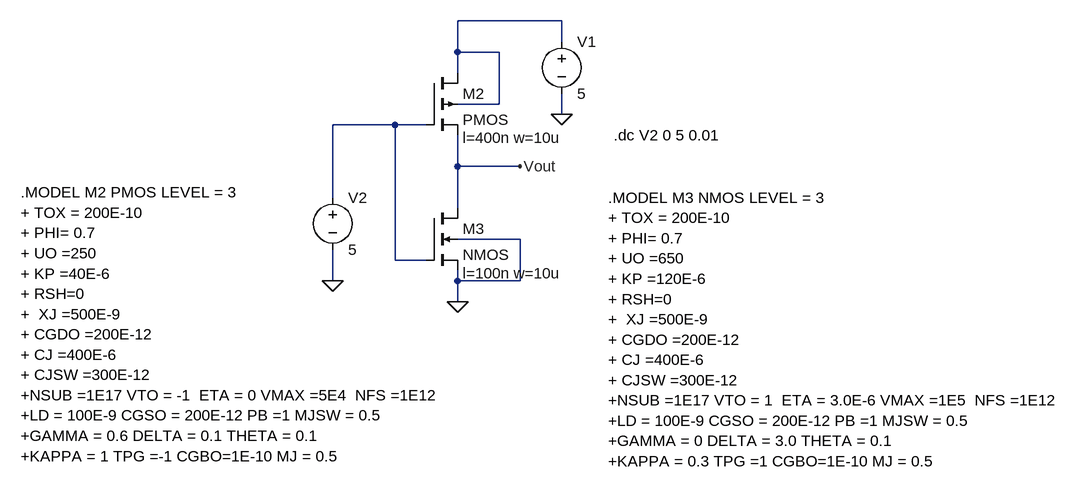
[diagram p0: schematic CMOS (Volatge Transfer Charecteristics).asc]
CMOS (Volatge Transfer Charecteristics).asc, the LTspice schematic file:
Version 4.1
SHEET 1 1100 680
WIRE 304 -32 144 -32
WIRE 304 0 304 -32
WIRE 144 16 144 -32
WIRE 208 16 144 16
WIRE 144 48 144 16
WIRE 208 96 208 16
WIRE 208 96 144 96
WIRE 304 112 304 80
WIRE 48 128 -48 128
WIRE 96 128 48 128
WIRE 144 192 144 144
WIRE 240 192 144 192
WIRE -48 240 -48 128
WIRE 144 256 144 192
WIRE 240 304 144 304
WIRE 48 336 48 128
WIRE 96 336 48 336
WIRE -48 368 -48 320
WIRE 144 368 144 352
WIRE 240 368 240 304
WIRE 240 368 144 368
WIRE 144 400 144 368
FLAG 304 112 0
FLAG -48 368 0
FLAG 240 192 Vout
FLAG 144 400 0
SYMBOL voltage 304 -16 R0
WINDOW 123 0 0 Left 0
WINDOW 39 0 0 Left 0
SYMATTR InstName V1
SYMATTR Value 5
SYMBOL voltage -48 224 R0
WINDOW 123 0 0 Left 0
WINDOW 39 0 0 Left 0
SYMATTR InstName V2
SYMATTR Value 5
SYMBOL nmos4 96 256 R0
WINDOW 123 56 100 Left 2
SYMATTR Value2 l=100n w=10u
SYMATTR InstName M3
SYMBOL pmos4 96 48 R0
WINDOW 123 56 100 Left 2
SYMATTR Value2 l=400n w=10u
SYMATTR InstName M2
TEXT 376 240 Left 2 !.MODEL M3 NMOS LEVEL = 3\n+ TOX = 200E-10\n+ PHI= 0.7\n+ UO =650\n+ KP =120E-6\n+ RSH=0\n+  XJ =500E-9\n+ CGDO =200E-12\n+ CJ =400E-6\n+ CJSW =300E-12\n+NSUB =1E17 VTO = 1  ETA = 3.0E-6 VMAX =1E5  NFS =1E12\n+LD = 100E-9 CGSO = 200E-12 PB =1 MJSW = 0.5\n+GAMMA = 0 DELTA = 3.0 THETA = 0.1\n+KAPPA = 0.3 TPG =1 CGBO=1E-10 MJ = 0.5
TEXT -528 232 Left 2 !.MODEL M2 PMOS LEVEL = 3\n+ TOX = 200E-10\n+ PHI= 0.7\n+ UO =250\n+ KP =40E-6\n+ RSH=0\n+  XJ =500E-9\n+ CGDO =200E-12\n+ CJ =400E-6\n+ CJSW =300E-12\n+NSUB =1E17 VTO = -1  ETA = 0 VMAX =5E4  NFS =1E12\n+LD = 100E-9 CGSO = 200E-12 PB =1 MJSW = 0.5\n+GAMMA = 0.6 DELTA = 0.1 THETA = 0.1\n+KAPPA = 1 TPG =-1 CGBO=1E-10 MJ = 0.5
TEXT 384 144 Left 2 !.dc V2 0 5 0.01

The netlist it stands for:
* CMOS (Volatge Transfer Charecteristics).asc
V1 N001 0 5
V2 N002 0 5
M3 Vout N002 0 0 NMOS l=100n w=10u
M2 N001 N002 Vout N001 PMOS l=400n w=10u
.model NMOS NMOS
.model PMOS PMOS
.lib standard.mos
.MODEL M3 NMOS LEVEL = 3
+ TOX = 200E-10
+ PHI= 0.7
+ UO =650
+ KP =120E-6
+ RSH=0
+  XJ =500E-9
+ CGDO =200E-12
+ CJ =400E-6
+ CJSW =300E-12
+NSUB =1E17 VTO = 1  ETA = 3.0E-6 VMAX =1E5  NFS =1E12
+LD = 100E-9 CGSO = 200E-12 PB =1 MJSW = 0.5
+GAMMA = 0 DELTA = 3.0 THETA = 0.1
+KAPPA = 0.3 TPG =1 CGBO=1E-10 MJ = 0.5
.MODEL M2 PMOS LEVEL = 3
+ TOX = 200E-10
+ PHI= 0.7
+ UO =250
+ KP =40E-6
+ RSH=0
+  XJ =500E-9
+ CGDO =200E-12
+ CJ =400E-6
+ CJSW =300E-12
+NSUB =1E17 VTO = -1  ETA = 0 VMAX =5E4  NFS =1E12
+LD = 100E-9 CGSO = 200E-12 PB =1 MJSW = 0.5
+GAMMA = 0.6 DELTA = 0.1 THETA = 0.1
+KAPPA = 1 TPG =-1 CGBO=1E-10 MJ = 0.5
.dc V2 0 5 0.01
.backanno
.end